# EAGLE design WDY_Power_Board (EAGLE 7.7.0)
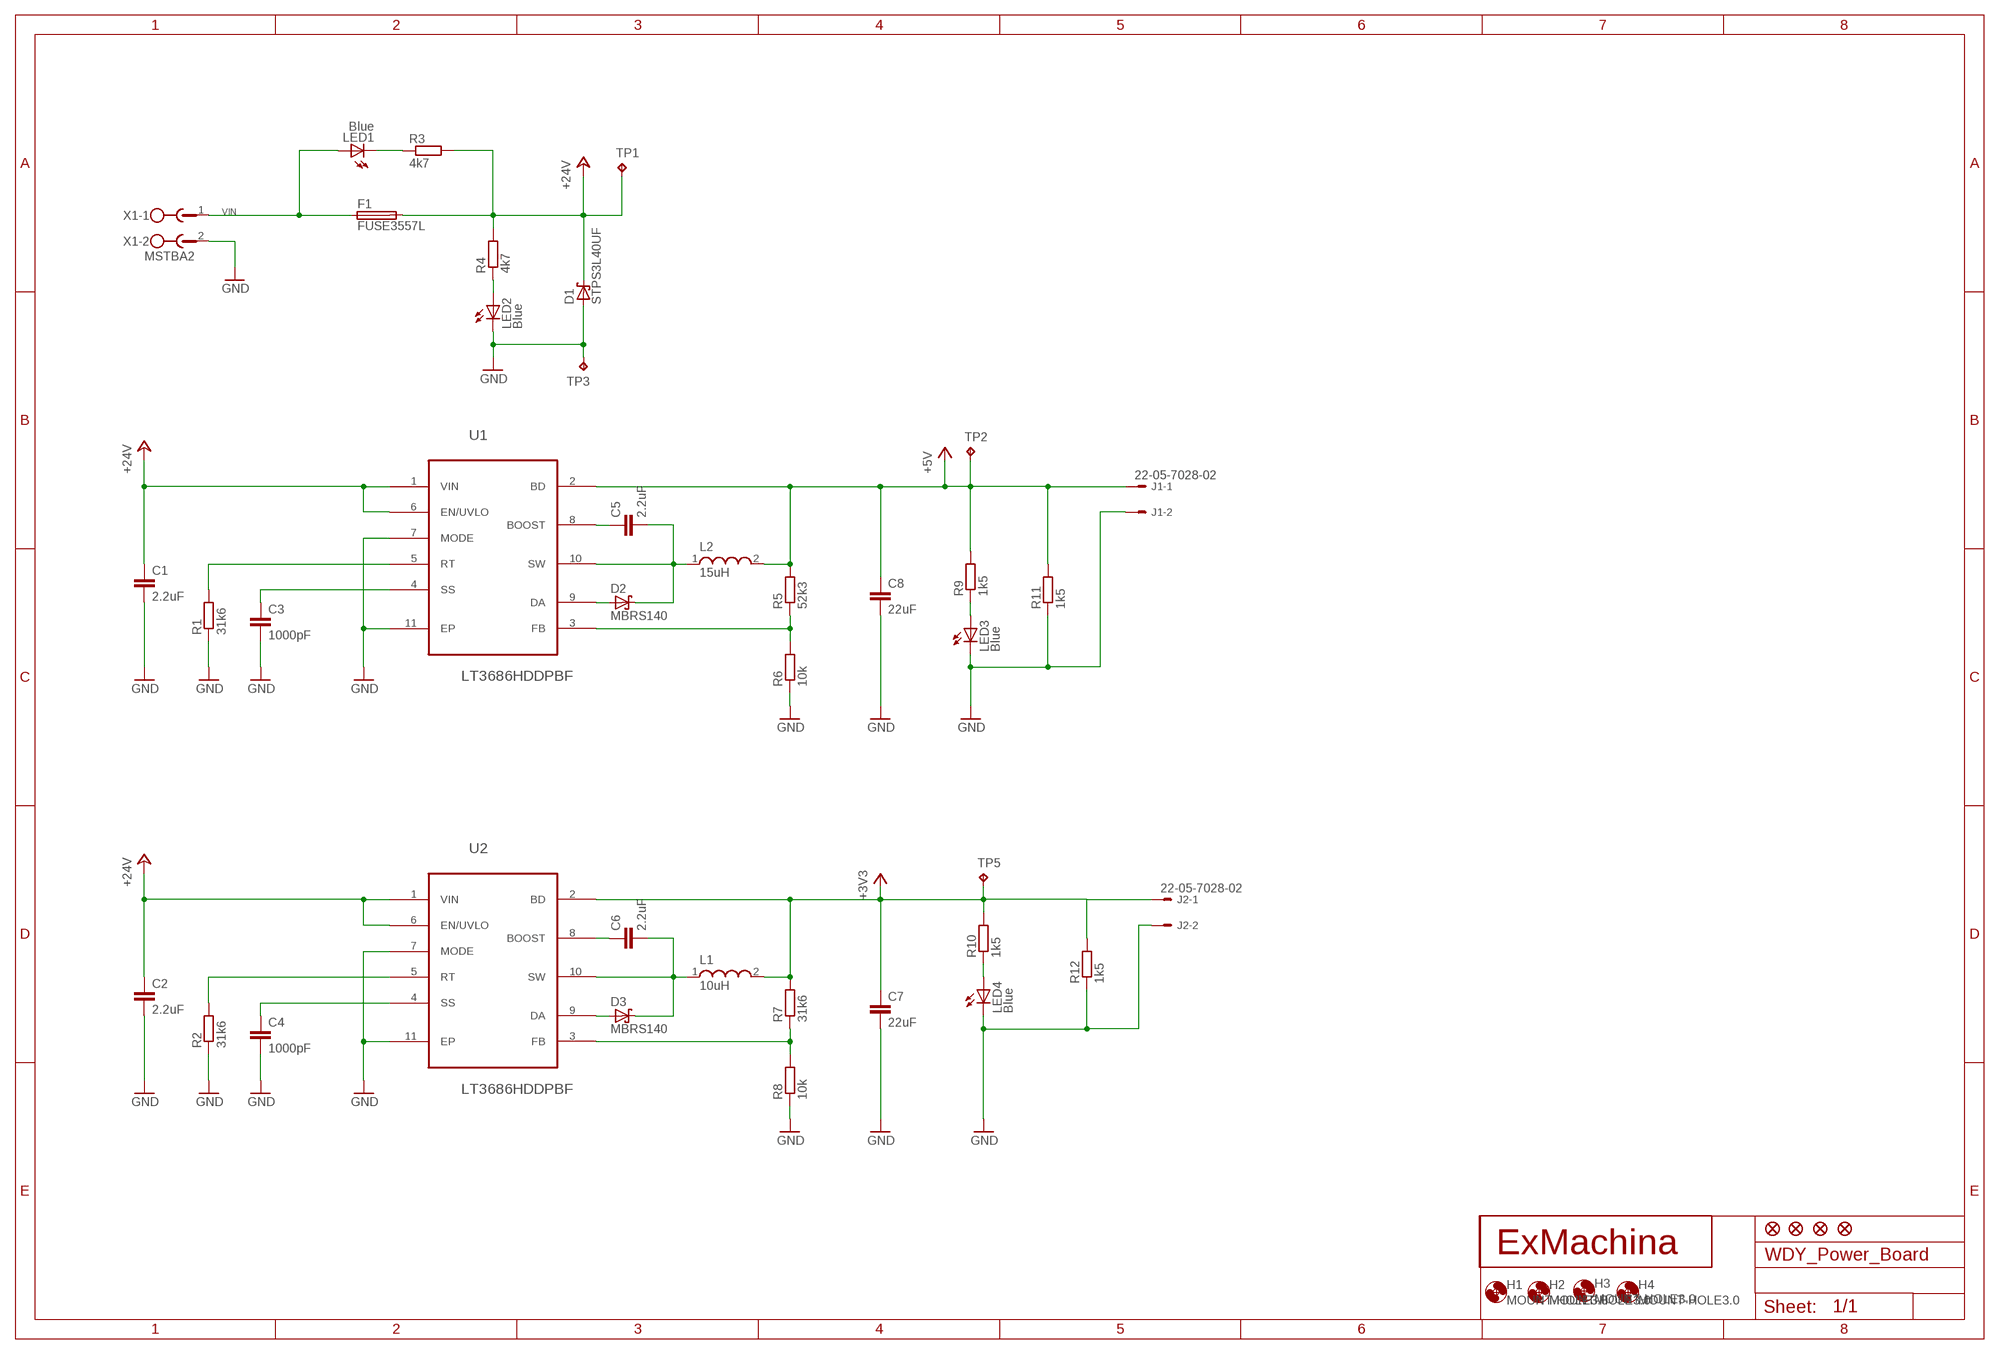
[diagram p0: schematic, sheet 1]

## Parts
C1  2.2uF  C-EUC0603  [C0603]
C2  2.2uF  C-EUC0603  [C0603]
C3  1000pF  C-EUC0603  [C0603]
C4  1000pF  C-EUC0603  [C0603]
C5  2.2uF  C-EUC0603  [C0603]
C6  2.2uF  C-EUC0603  [C0603]
C7  22uF  C-EUC0805  [C0805]
C8  22uF  C-EUC0805  [C0805]
D1  STPS3L40UF  [SMB]
D2  MBRS140  [DO-214AA]
D3  MBRS140  [DO-214AA]
F1  FUSE3557L  [3557-LITTLE]
H1  MOUNT-HOLE3.0  [3,0]
H2  MOUNT-HOLE3.0  [3,0]
H3  MOUNT-HOLE3.0  [3,0]
H4  MOUNT-HOLE3.0  [3,0]
J1  22-05-7028-02  [7395-02]
J2  22-05-7028-02  [7395-02]
JP1  FIDUCIAL1X2  [FIDUCIAL-1X2]
JP2  FIDUCIAL1X2  [FIDUCIAL-1X2]
JP3  FIDUCIAL1X2  [FIDUCIAL-1X2]
JP4  FIDUCIAL1X2  [FIDUCIAL-1X2]
L1  10uH  WE-PD2_5848/5820  [WE-PD2_5848/5820]
L2  15uH  WE-PD2_5848/5820  [WE-PD2_5848/5820]
LED1  Blue  LEDCHIPLED_0603  [CHIPLED_0603]
LED2  Blue  LEDCHIPLED_0603  [CHIPLED_0603]
LED3  Blue  LEDCHIP-LED0603  [CHIP-LED0603]
LED4  Blue  LEDCHIP-LED0603  [CHIP-LED0603]
R1  31k6  R-EU_R0603  [R0603]
R2  31k6  R-EU_R0603  [R0603]
R3  4k7  R-EU_R0603  [R0603]
R4  4k7  R-EU_R0603  [R0603]
R5  52k3  R-EU_R0603  [R0603]
R6  10k  R-EU_R0603  [R0603]
R7  31k6  R-EU_R0603  [R0603]
R8  10k  R-EU_R0603  [R0603]
R9  1k5  R-EU_R0603  [R0603]
R10  1k5  R-EU_R0603  [R0603]
R11  1k5  R-EU_R0603  [R0603]
R12  1k5  R-EU_R0603  [R0603]
TP1  TPB1,27  [B1,27]
TP2  TPB1,27  [B1,27]
TP3  TPB1,27  [B1,27]
TP5  TPB1,27  [B1,27]
U1  LT3686HDDPBF  [DFN300X300X80-11N]
U2  LT3686HDDPBF  [DFN300X300X80-11N]
U$1  EXMACHINA-LOGO-NAME  [EXM-LOGO-BASELINE]
X1  MSTBA2  [MSTBA2]

## Nets
+3V3 [supply]: C7.1 J2.1 L1.2 R7.2 R10.2 R12.2 TP5.TP U2.2(BD)
+5V [supply]: C8.1 J1.1 L2.2 R5.2 R9.2 R11.2 TP2.TP U1.2(BD)
+24V: C1.1 C2.1 D1.C F1.3 F1.4 R3.2 R4.2 TP1.TP U1.1(VIN) U1.6(EN/UVLO) U2.1(VIN) U2.6(EN/UVLO)
GND [supply]: C1.2 C2.2 C3.2 C4.2 C7.2 C8.2 D1.A J1.2 J2.2 LED2.C LED3.C LED4.C R1.1 R2.1 R6.1 R8.1 R11.1 R12.1 TP3.TP U1.7(MODE) U1.11(EP) U2.7(MODE) U2.11(EP) X1.2
N$1: R1.2 U1.5(RT)
N$2: R7.1 R8.2 U2.3(FB)
N$3: C3.1 U1.4(SS)
N$4: R2.2 U2.5(RT)
N$5: C4.1 U2.4(SS)
N$6: R5.1 R6.2 U1.3(FB)
N$7: C6.1 U2.8(BOOST)
N$8: C5.1 U1.8(BOOST)
N$9: C5.2 D2.C L2.1 U1.10(SW)
N$10: D2.A U1.9(DA)
N$11: C6.2 D3.C L1.1 U2.10(SW)
N$12: D3.A U2.9(DA)
N$44: LED2.A R4.1
N$45: LED1.C R3.1
N$50: LED4.A R10.1
N$51: LED3.A R9.1
VIN: F1.1 F1.2 LED1.A X1.1

## Library data of the parts
C1 C2 C5 C6 = rcl:C-EU: CAPACITOR, European symbol; MPN: GRT188R61H225KE13D; OC_NEWARK: 01AC8938
C3 C4 = rcl:C-EU: CAPACITOR, European symbol; MPN: MC0603B102K500CT; OC_NEWARK: 06R4910
C7 C8 = rcl:C-EU: CAPACITOR, European symbol; MPN: MCMT21N220F250CT; OC_NEWARK: 23T7233
D1 = diode:STPS3L40?; MP: STMICROELECTRONICS; MPN: STPS3L40UF; OC_FARNELL: 2341599; OC_NEWARK: 06X0873
D2 D3 = diode:MBRS140: Redresseur Schottky, 40 V, 1 A, Une, DO-214AA, 2 Broche(s), 600 mV; MF: ON SEMICONDUCTOR; MPN: MBRS140T3G; OC_NEWARK: 83H7272
F1 = fuse2:FUSE: Fuse; MPN: 3557; OC_NEWARK: 22M2711
H1-H4 = holes:MOUNT-HOLE: MOUNTING HOLE with drill center marker; OC_NEWARK: unknown
J1 J2 = con-molex:22-?-02: CONNECTOR wire to board 2.54 mm (.1 inch) pitch header; MPN: 22-05-7028; OC_FARNELL: 9731601; OC_NEWARK: 25M1728
JP1-JP4 = SparkFun:FIDUCIAL: Fiducial Alignment Points Various fiducial points for machine vision alignment.; OC_NEWARK: unknown
L1 = Wurth-POWER_MAGNETICS-rev16f:WE-PD2: SMD Power Inductor Characteristics Open size Saturation currents up to 14 A Low tolerances at high inductance values Operating temperature: –40 °C to +125 °C Applications Integrated DC/DC-converter Switching regulators with low operating voltages (Graphic cards, embedded PC-Cards, Mainboards) Optimal attenuation in MHz frequency range Details see: http://katalog.we-online.de/en/pbs/WE-PD2 Updated by Dan Xu 2014-07-08 2014 (C) Wurth Elektronik; MPN: 74477410; OC_NEWARK: 08P2817
L2 = Wurth-POWER_MAGNETICS-rev16f:WE-PD2: SMD Power Inductor Characteristics Open size Saturation currents up to 14 A Low tolerances at high inductance values Operating temperature: –40 °C to +125 °C Applications Integrated DC/DC-converter Switching regulators with low operating voltages (Graphic cards, embedded PC-Cards, Mainboards) Optimal attenuation in MHz frequency range Details see: http://katalog.we-online.de/en/pbs/WE-PD2 Updated by Dan Xu 2014-07-08 2014 (C) Wurth Elektronik; MPN: 744774115; OC_NEWARK: 08P2818
LED1 LED2 = led:LED: LED OSRAM: - CHIPLED LG R971, LG N971, LY N971, LG Q971, LY Q971, LO R971, LY R971 LH N974, LH R974 LS Q976, LO Q976, LY Q976 LO Q996 - Hyper CHIPLED LW Q18S LB Q993, LB Q99A, LB R99A - SideLED LS A670, LO A670, LY A670, LG A670, LP A670 LB A673, LV A673, LT A673, LW A673 LH A674 LY A675 LS A676, LA A676, LO A676, LY A676, LW A676 LS A679, LY A679, LG A679 - Hyper Micro SIDELED® LS Y876, LA Y876, LO Y876, LY Y876 LT Y87S - SmartLED LW L88C, LW L88S LB L89C, LB L89S, LG L890 LS L89K, LO L89K, LY L89K LS L896, LA L896, LO L896, LY L896 - TOPLED LS T670, LO T670, LY T670, LG T670, LP T670 LSG T670, LSP T670, LSY T670, LOP T670, LYG T670 LG T671, LOG T671, LSG T671 LB T673, LV T673, LT T673, LW T673 LH T674 LS T676, LA T676, LO T676, LY T676, LB T676, LH T676, LSB T676, LW T676 LB T67C, LV T67C, LT T67C, LS T67K, LO T67K, LY T67K, LW E67C LS E67B, LA E67B, LO E67B, LY E67B, LB E67C, LV E67C, LT E67C LW T67C LS T679, LY T679, LG T679 LS T770, LO T770, LY T770, LG T770, LP T770 LB T773, LV T773, LT T773, LW T773 LH T774 LS E675, LA E675, LY E675, LS T675 LS T776, LA T776, LO T776, LY T776, LB T776 LHGB T686 LT T68C, LB T68C - Hyper Mini TOPLED® LB M676 - Mini TOPLED Santana® LG M470 LS M47K, LO M47K, LY M47K Source: http://www.osram.convergy.de LUXEON: - LUMILED® LXK2-PW12-R00, LXK2-PW12-S00, LXK2-PW14-U00, LXK2-PW14-V00 LXK2-PM12-R00, LXK2-PM12-S00, LXK2-PM14-U00 LXK2-PE12-Q00, LXK2-PE12-R00, LXK2-PE12-S00, LXK2-PE14-T00, LXK2-PE14-U00 LXK2-PB12-K00, LXK2-PB12-L00, LXK2-PB12-M00, LXK2-PB14-N00, LXK2-PB14-P00, LXK2-PB14-Q00 LXK2-PR12-L00, LXK2-PR12-M00, LXK2-PR14-Q00, LXK2-PR14-R00 LXK2-PD12-Q00, LXK2-PD12-R00, LXK2-PD12-S00 LXK2-PH12-R00, LXK2-PH12-S00 LXK2-PL12-P00, LXK2-PL12-Q00, LXK2-PL12-R00 Source: www.luxeon.com KINGBRIGHT: KA-3528ASYC Source: www.kingbright.com; MPN: OVS-0603; OC_NEWARK: 15R2205
LED3 LED4 = led:LED: LED OSRAM: - CHIPLED LG R971, LG N971, LY N971, LG Q971, LY Q971, LO R971, LY R971 LH N974, LH R974 LS Q976, LO Q976, LY Q976 LO Q996 - Hyper CHIPLED LW Q18S LB Q993, LB Q99A, LB R99A - SideLED LS A670, LO A670, LY A670, LG A670, LP A670 LB A673, LV A673, LT A673, LW A673 LH A674 LY A675 LS A676, LA A676, LO A676, LY A676, LW A676 LS A679, LY A679, LG A679 - Hyper Micro SIDELED® LS Y876, LA Y876, LO Y876, LY Y876 LT Y87S - SmartLED LW L88C, LW L88S LB L89C, LB L89S, LG L890 LS L89K, LO L89K, LY L89K LS L896, LA L896, LO L896, LY L896 - TOPLED LS T670, LO T670, LY T670, LG T670, LP T670 LSG T670, LSP T670, LSY T670, LOP T670, LYG T670 LG T671, LOG T671, LSG T671 LB T673, LV T673, LT T673, LW T673 LH T674 LS T676, LA T676, LO T676, LY T676, LB T676, LH T676, LSB T676, LW T676 LB T67C, LV T67C, LT T67C, LS T67K, LO T67K, LY T67K, LW E67C LS E67B, LA E67B, LO E67B, LY E67B, LB E67C, LV E67C, LT E67C LW T67C LS T679, LY T679, LG T679 LS T770, LO T770, LY T770, LG T770, LP T770 LB T773, LV T773, LT T773, LW T773 LH T774 LS E675, LA E675, LY E675, LS T675 LS T776, LA T776, LO T776, LY T776, LB T776 LHGB T686 LT T68C, LB T68C - Hyper Mini TOPLED® LB M676 - Mini TOPLED Santana® LG M470 LS M47K, LO M47K, LY M47K Source: http://www.osram.convergy.de LUXEON: - LUMILED® LXK2-PW12-R00, LXK2-PW12-S00, LXK2-PW14-U00, LXK2-PW14-V00 LXK2-PM12-R00, LXK2-PM12-S00, LXK2-PM14-U00 LXK2-PE12-Q00, LXK2-PE12-R00, LXK2-PE12-S00, LXK2-PE14-T00, LXK2-PE14-U00 LXK2-PB12-K00, LXK2-PB12-L00, LXK2-PB12-M00, LXK2-PB14-N00, LXK2-PB14-P00, LXK2-PB14-Q00 LXK2-PR12-L00, LXK2-PR12-M00, LXK2-PR14-Q00, LXK2-PR14-R00 LXK2-PD12-Q00, LXK2-PD12-R00, LXK2-PD12-S00 LXK2-PH12-R00, LXK2-PH12-S00 LXK2-PL12-P00, LXK2-PL12-Q00, LXK2-PL12-R00 Source: www.luxeon.com KINGBRIGHT: KA-3528ASYC Source: www.kingbright.com; MPN: OVS-0604; OC_FARNELL: 1716771; OC_NEWARK: 15R2206
R1 R2 R7 R9-R12 = rcl:R-EU_: RESISTOR, European symbol; MF: Multicomp Passives; MPN: MC0063W060311K5; OC_FARNELL: 2073391; OC_NEWARK: 58K4488
R3 R4 = rcl:R-EU_: RESISTOR, European symbol; MPN: MCMR06X4701FTL; OC_NEWARK: 86T3649
R5 = rcl:R-EU_: RESISTOR, European symbol; MPN: MC0063W0603152K3; OC_FARNELL: 2073391; OC_NEWARK: 26M0962
R6 R8 = rcl:R-EU_: RESISTOR, European symbol; MPN: MCMR06X1002FTL; OC_FARNELL: 2073391; OC_NEWARK: 86T3506
TP1 TP3 = testpad:TP: Test pad; OC_NEWARK: unknown
TP2 TP5 = testpad:TP: Test pad; OC_FARNELL: unknown; OC_NEWARK: unknown
U1 U2 = lineartechnology:LT3686HDDPBF: 37V/1.2A Step-DownRegulator in 3mm × 3mm DFN; MPN: LT3686HDD#PBF; OC_FARNELL: 2294943; OC_NEWARK: 78R8986; PACKAGE: DFN-10; SUPPLIER: Linear Technology
U$1 = exmachina:EXMACHINA-LOGO; OC_NEWARK: unknown
X1 = con-phoenix-508:MSTBA2: PHOENIX; MF: FARNELL; MPN: 1757242; OC_FARNELL: 3705171; OC_NEWARK: 71C4161

## Net classes
2 supply: width 0.008 mm, drill 0.5 mm

## Board
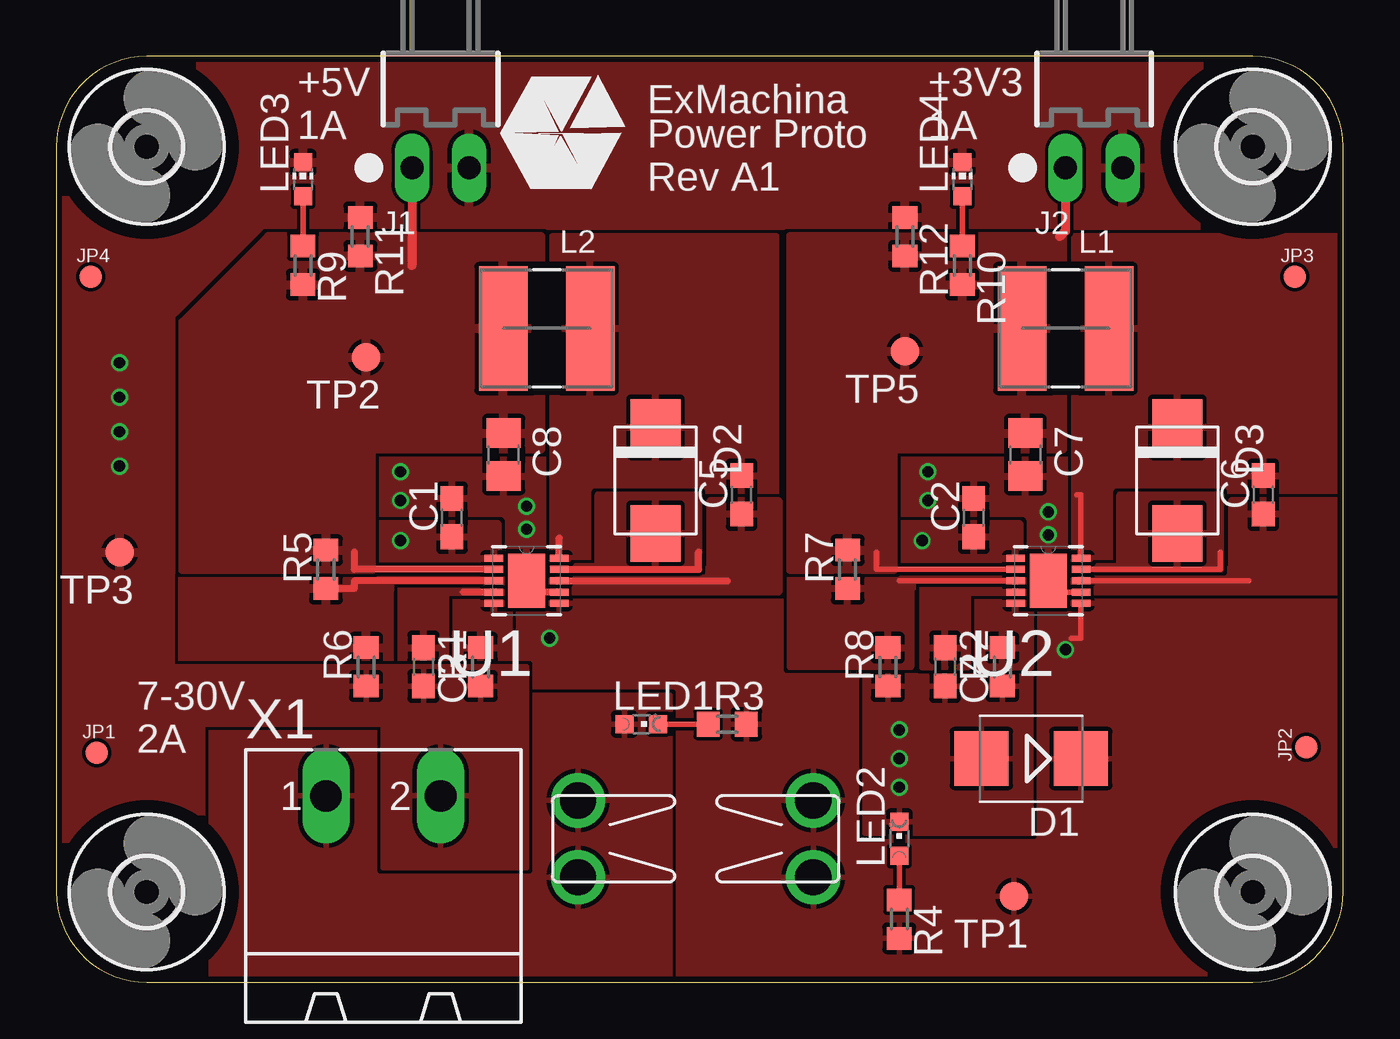
[diagram p1: board, top side]
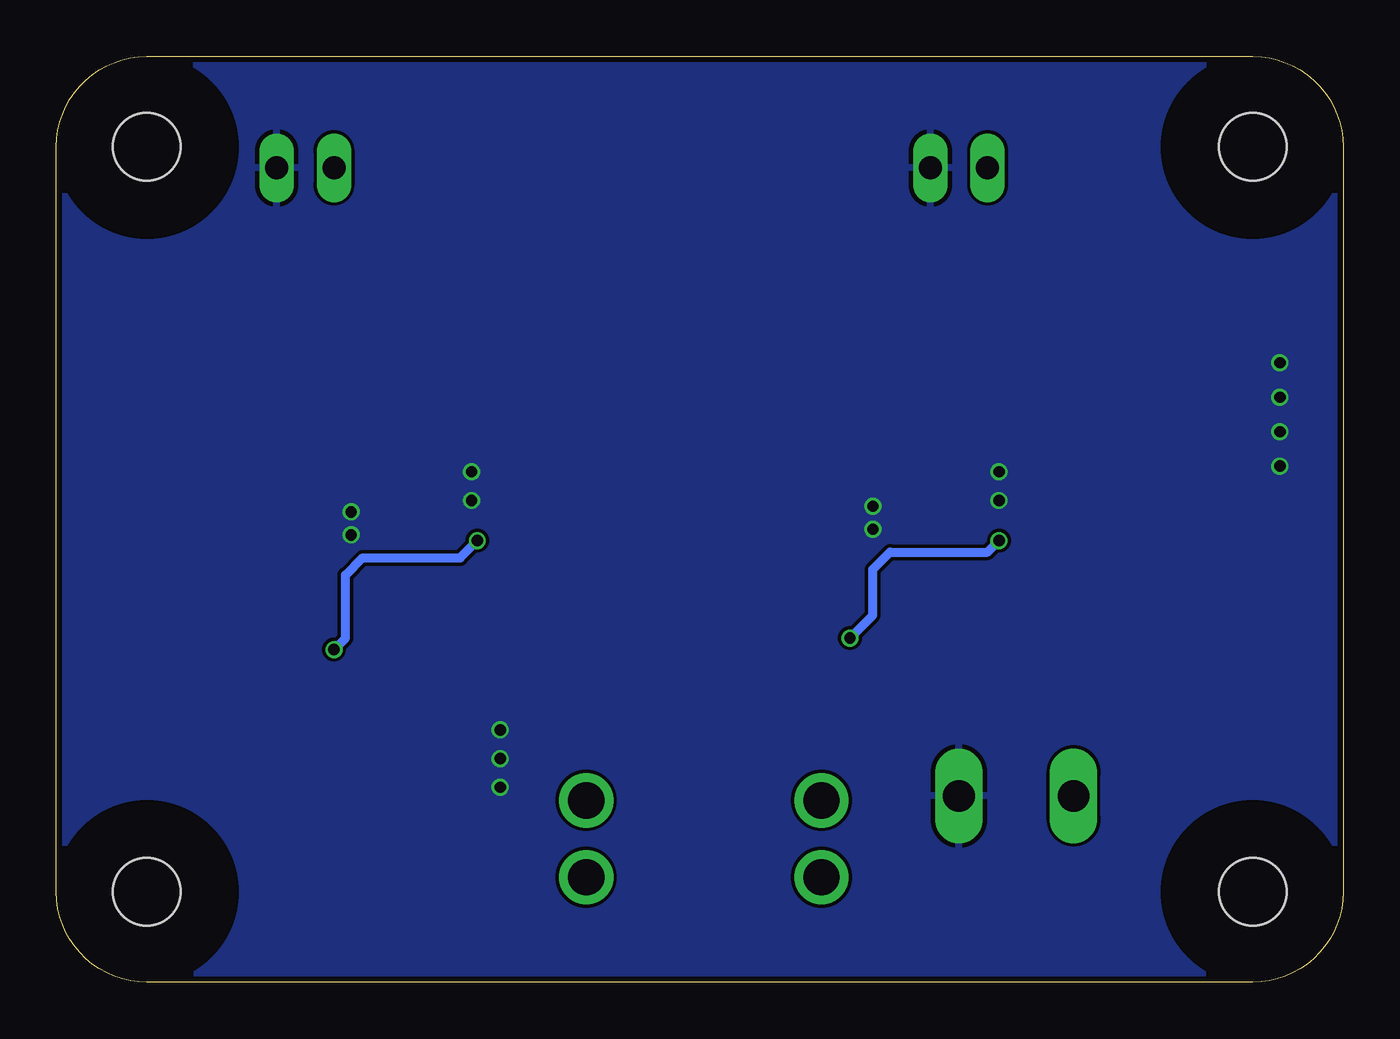
[diagram p2: board, bottom side, seen from below]

Size 57 x 41 mm. Coordinates in mm from the lower left corner, seen from the top.
Outline: 0,37 0,4 arc90 4,0 53,0 arc90 57,4 57,37 arc90 53,41 4,41 arc90 0,37
Copper layers (1*16): Top 0.018mm / dielectric 1.55mm / Bottom 0.018mm
Design rules "eC_2Layer_PClass6_BaseCopperO18_eCDefault": minimum track width 0.15mm, minimum drill 0.35mm, track to track 0.15mm, track to pad 0.15mm, pad to pad 0.15mm, via to via 0.15mm, smd to smd 0mil, copper to edge 0.25mm, drill to drill 0.35mm, minimum pad ring 0.175mm, minimum via ring 0.125mm, stop-mask expansion 0mil, vias tented up to drill 0.45mm, thermal gap 0.2mm

### Footprints (pad centres in the part's own frame; a part is rotated, then mirrored left to right if it is on the bottom)
C0603 = smd 1.1 x 1: 1 -0.85,0; 2 0.85,0
C0805 = smd 1.3 x 1.5: 1 -0.95,0; 2 0.95,0
SMB = smd 2.4 x 2.4: A 2.2,0; C -2.2,0
DO-214AA = smd 2.5 x 2.2: A 2.35,0; C -2.35,0
3557-LITTLE = drill 1.6: 1 -5.207,-1.702; 2 -5.207,1.702; 3 5.207,-1.702; 4 5.207,1.702
3,0 = hole 3: 0,0
7395-02 = drill 1.016 long: 1 1.27,0; 2 -1.27,0
FIDUCIAL-1X2 = smd 1 x 1: 1 0,0
WE-PD2_5848/5820 = smd 2.15 x 5.5: 1 -1.925,0; 2 1.925,0
CHIPLED_0603 = smd 0.8 x 0.8: A 0,-0.75; C 0,0.75
CHIP-LED0603 = smd 0.8 x 0.8: A 0,-0.75; C 0,0.75
R0603 = smd 1 x 1.1: 1 -0.85,0; 2 0.85,0
B1,27 = smd 1.27 x 1.27: TP 0,0
DFN300X300X80-11N = smd 0.813 x 0.305: 1 -1.448,0.991; 2 -1.448,0.508; 3 -1.448,0; 4 -1.448,-0.508; 5 -1.448,-0.991; 6 1.448,-0.991; 7 1.448,-0.508; 8 1.448,0; 9 1.448,0.508; 10 1.448,0.991 | smd 1.651 x 2.388: 11 0,0
MSTBA2 = drill 1.397 long: 1 -2.54,5.08; 2 2.54,5.08

### Placement (x,y rotation side)
C1  17.53,20.57 90 top
C2  40.64,20.57 90 top
C3  16.26,13.97 270 top
C4  39.37,13.97 270 top
C5  30.35,21.59 90 top
C6  53.47,21.59 90 top
C7  42.93,23.37 270 top
C8  19.81,23.37 270 top
D1  43.18,9.91 180 top
D2  26.54,22.23 270 top
D3  49.66,22.23 270 top
F1  28.32,6.35 0 top
H1  53,4 0 top
H2  53,37 0 top
H3  4,37 0 top
H4  4,4 0 top
J1  17.02,36.07 180 top
J2  45.97,36.07 180 top
JP1  1.78,10.16 0 top
JP2  55.37,10.41 90 top
JP3  54.86,31.24 0 top
JP4  1.52,31.24 0 top
L1  44.7,28.96 180 top
L2  21.72,28.96 180 top
LED1  25.91,11.43 270 top
LED2  37.34,6.35 0 top
LED3  10.92,35.56 0 top
LED4  40.13,35.56 0 top
R1  18.8,13.97 90 top
R2  41.91,13.97 90 top
R3  29.72,11.43 0 top
R4  37.34,2.79 270 top
R5  11.94,18.29 90 top
R6  13.72,13.97 90 top
R7  35.05,18.29 90 top
R8  36.83,13.97 90 top
R9  10.92,31.75 270 top
R10  40.13,31.75 270 top
R11  13.46,33.02 270 top
R12  37.59,33.02 270 top
TP1  42.42,3.81 180 top
TP2  13.72,27.69 180 top
TP3  2.79,19.05 180 top
TP5  37.59,27.94 180 top
U1  20.83,17.78 0 top
U2  43.94,17.78 0 top
U$1  22.35,37.59 0 top
X1  14.48,3.17 0 top

### Tracks (layer width: path | path; a pad name or v marks a point on that pad's centre or on a via)
+3V3
  Top 0.254: U2.2 36.32,18.29 36.32,19.05
  Top 0.406: J2.1 44.7,33.27 44.45,33.02
  pour Top: 32.51,18.29 37.08,18.29 37.08,23.62 44.58,23.62 44.58,33.02 32.51,33.02
+5V
  Top 0.305: U1.2 13.21,18.29 13.21,19.05
  Top 0.406: J1.1 15.75,31.75
  pour Top: 5.59,18.29 13.97,18.29 13.97,23.62 21.46,23.62 21.46,33.02 9.4,33.02 5.59,29.21
+24V  (via drill 0.5)
  Top 0.254: U2.6 45.39,15.24 44.96,15.24
  Bottom 0.406: v38.35,19.56 39.12,18.8 43.43,18.8 44.2,18.03 44.2,15.24 v44.7,14.73 | v15.24,19.56 15.75,19.05 20.07,19.05 20.83,18.29 20.83,16.26 v21.84,15.24
  pour Top (rank 2): 14.22,20.32 19.56,20.32 19.56,18.54 14.22,18.54
  pour Top (rank 2): 37.34,20.32 42.67,20.32 42.67,18.54 37.34,18.54
  pour Top (rank 6): 20.32,17.02 59.44,17.02 59.44,-0.76 20.32,-0.76
GND  (via drill 0.5)
  Top 0.254: U2.7 43.94,17.27 U2.11
  Top 0.305: U1.7 20.83,17.27 U1.11
  other vias: 15.24,22.61 15.24,21.34 20.83,21.08 20.83,20.07 43.94,19.81 43.94,20.83 38.61,21.34 38.61,22.61 37.34,8.64 37.34,9.91 37.34,11.18 2.79,27.43 2.79,25.91 2.79,24.38 2.79,22.86
  pour Top (rank 6): 14.22,20.57 19.81,20.57 19.81,17.53 23.11,17.53 23.11,23.37 14.22,23.37
  pour Bottom: -12.7,-1.27 -12.7,52.07 81.79,52.07 81.79,-1.27
  pour Top (rank 6): 37.34,20.57 42.93,20.57 42.93,18.03 46.23,18.03 46.23,23.37 37.34,23.37
  pour Top (rank 5): 35.81,13.97 43.18,13.97 43.18,6.6 35.81,6.6
  pour Top: -0.76,13.97 20.83,13.97 20.83,5.08 14.48,5.08 14.48,11.43 -0.76,11.43
  pour Top (rank 6): 6.86,-2.54 -2.03,-2.54 -2.03,44.45 64.01,44.45 64.01,27.94 62.74,26.67 6.86,26.67
N$1
  pour Top (rank 4): 17.53,13.97 20.07,13.97 20.07,17.27 17.53,17.27
N$2
  Top 0.254: U2.3 37.34,17.78
  pour Top (rank 3): 32.51,18.03 43.18,18.03 43.18,17.53 37.85,17.53 37.85,13.97 32.51,13.97
N$3
  Top 0.305: U1.4 18.03,17.27
  pour Top (rank 2): 15.24,13.97 17.27,13.97 17.27,17.27 20.07,17.27 20.07,17.53 15.24,17.53
N$4
  pour Top (rank 4): 40.64,13.97 43.18,13.97 43.18,17.27 40.64,17.27
N$5
  pour Top (rank 2): 38.35,13.97 40.39,13.97 40.39,17.27 43.18,17.27 43.18,17.53 38.35,17.53
N$6
  Top 0.305: U1.3 13.21,17.78 13.21,17.44 R5.1
  pour Top (rank 3): 5.59,18.03 20.07,18.03 20.07,17.53 14.73,17.53 14.73,13.97 5.59,13.97
N$7
  Top 0.254: U2.8 52.83,17.78
  pour Top (rank 2): 45.21,18.29 52.07,18.29 52.07,21.34 60.2,21.34 60.2,17.27 44.96,17.27
N$8
  Top 0.305: U1.8 29.72,17.78
  pour Top (rank 2): 22.1,18.29 28.96,18.29 28.96,21.34 32,21.34 32,17.27 21.84,17.27
N$9
  Top 0.305: U1.10 22.28,19.68
  pour Top (rank 5): 21.97,33.02 21.97,18.67 24,18.67 24,21.59 31.88,21.59 31.88,33.02
N$10
  Top 0.305: U1.9 28.45,18.29 28.45,19.05
  pour Top (isolate 0.254): 24,21.59 28.45,21.59 28.45,18.29 20.83,18.29 20.83,18.41 24,18.41
N$11
  Top 0.254: U2.10 45.39,21.59 45.21,21.59
  pour Top (rank 5): 45.09,33.02 45.09,18.67 47.12,18.67 47.12,21.59 59.82,21.59 59.82,33.02
N$12
  Top 0.254: U2.9 51.56,18.29 51.56,19.05
  pour Top (isolate 0.254): 47.12,21.59 51.56,21.59 51.56,18.29 43.94,18.29 43.94,18.41 47.12,18.41
N$44
  Top 0.254: R4.1 LED2.A
N$45
  Top 0.254: LED1.C R3.1
N$50
  Top 0.254: R10.1 LED4.A
N$51
  Top 0.254: R9.1 LED3.A
VIN
  pour Top (rank 5): 6.86,12.7 27.18,12.7 27.18,-1.27 6.86,-1.27

### Text on the board
tPlace: +5V / 1A | +3V3 / 1A | Power Proto / Rev A1 | 7-30V / 2A